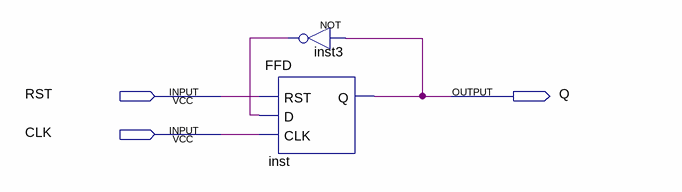
[diagram p0: schematic sheet]
// Quartus schematic FFD_Divisor.bdf as structural Verilog: 2 symbols, 3 pins
module FFD_Divisor (
  input  RST,
  input  CLK,
  output Q
);

  wire inst3_out;

  FFD inst (.RST(RST), .D(inst3_out), .CLK(CLK), .Q(Q));
  not inst3 (inst3_out, Q);
endmodule
